# Altium schematic sheet CH340N.SchDoc
size A4; SheetNumber: 4; SheetTotal: 17
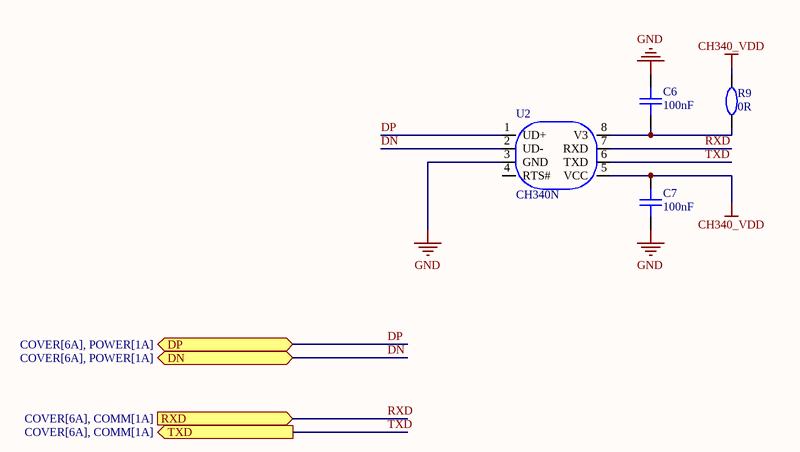
[diagram p0: CH340N.SchDoc]

## Parts
C6  100nF  [C0402]
C7  100nF  [C0402]
R9  0R  [R0402]
U2  CH340N  [SOP-8_L4.9-W3.9-P1.27-LS6.0-BL]

## Ports
DN (bidir, see COVER[6A], POWER[1A]), DP (bidir, see COVER[6A], POWER[1A]), RXD (in, see COVER[6A], COMM[1A]), TXD (out, see COVER[6A], COMM[1A])

## Nets
CH340_VDD: C7.2 R9.2 U2.5(VCC)
GND: C6.2 C7.1 U2.3(GND)
DN: U2.2(UD-) ; port DN
DP: U2.1(UD+) ; port DP
RXD: U2.7(RXD) ; port RXD
TXD: U2.6(TXD) ; port TXD
NetC6_1: C6.1 R9.1 U2.8(V3)

Not connected (* = marked no-connect by the designer): U2 4(RTS#)

## Library data of the parts
C6 C7 = CAP_0402: Symbol: CapAcitance; Device: CAP_0603; Convert to PCB: yes; Add into BOM: yes; Supplier Footprint: 0603; Value: 100nF; Name: 100nF
R9 = Res_0402: Symbol: 电阻; Device: Res_0603; Convert to PCB: yes; Add into BOM: yes; Supplier Footprint: 0603; Value: 0R; Name: 0R
U2 = CH340N: Manufacturer: WCH(南京沁恒); Symbol: CH340N_C2977777; Add into BOM: yes; Applications Function: USB转串口; Protocol: USB 2.0; Number of Channels: 1; Voltage - Supply: 3.3V；5V; Data Rate: 2Mbps; Device: CH340N; LCSC Part Name: USB2.0芯片CH340; Supplier Part: C2977777; Manufacturer Part: CH340N; Supplier Footprint: SOP-8; Datasheet: https://atta.szlcsc.com/upload/public/pdf/source/20240313/115CDE92081B1D6CB446704AD5D0F5F2.pdf; Supplier: LCSC; Convert to PCB: yes; Operating Temperature: -20℃~+70℃; Name: CH340N